# Altium schematic sheet Voltage Controller.SchDoc
size A4
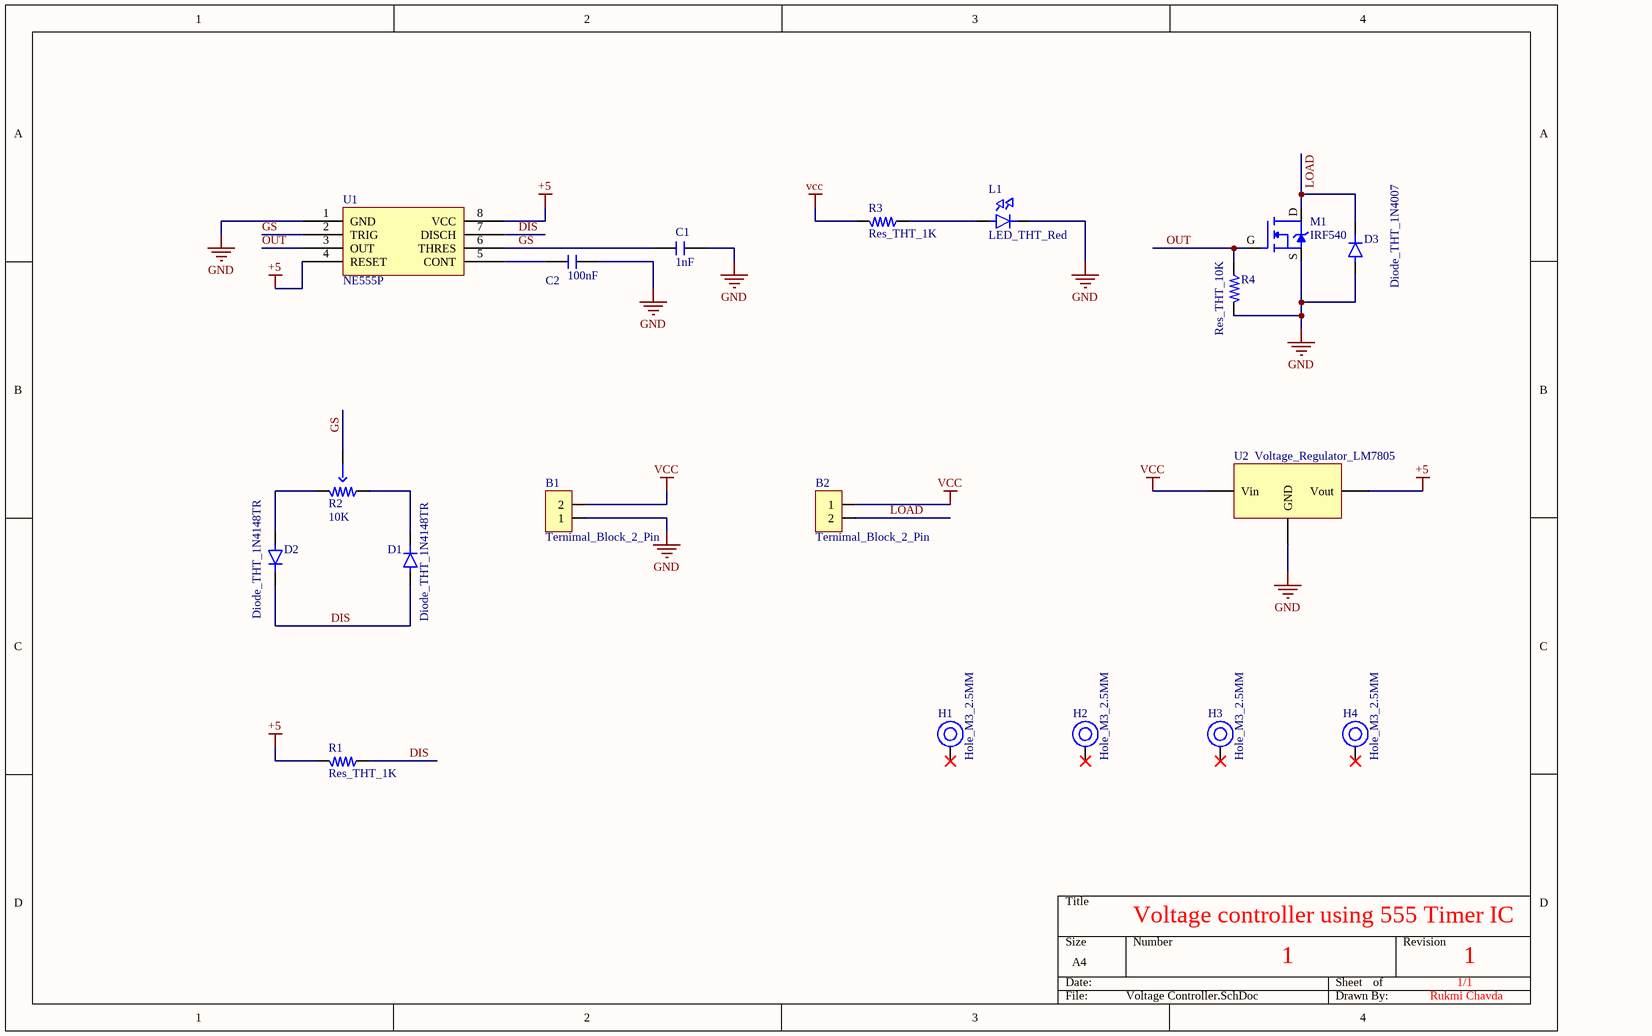
[diagram p0: Voltage Controller.SchDoc]

## Parts
B1  Ternimal_Block_2_Pin  [Ternimal_Block_2_Pin]
B2  Ternimal_Block_2_Pin  [Ternimal_Block_2_Pin]
C1  1nF  [Cap_5.5mm_Cerimic]
C2  100nF  [Cap_5.5mm_Cerimic]
D1  Diode_THT_1N4148TR  [Diode_THT_1N4148TR]
D2  Diode_THT_1N4148TR  [Diode_THT_1N4148TR]
D3  Diode_THT_1N4007  [Diode_1N4007]
H1  Hole_M3_2.5MM  [M3 Hole]  (no BOM)
H2  Hole_M3_2.5MM  [M3 Hole]  (no BOM)
H3  Hole_M3_2.5MM  [M3 Hole]  (no BOM)
H4  Hole_M3_2.5MM  [M3 Hole]  (no BOM)
L1  LED_THT_Red  [LED_THT_Red]
M1  IRF540  [irf540]
R1  Res_THT_1K  [Res_THT_1K]
R2  10K  [Potentiometer_2]
R3  Res_THT_1K  [Res_THT_1K]
R4  Res_THT_10K  [Res_THT_10K]
U1  NE555P  [NE555]
U2  Voltage_Regulator_LM7805  [LM7805_THT]

## Nets
+5: R1.1 U1.4(RESET) U1.8(VCC) U2.3(Vout)
GND: B1.1 C1.2 C2.2 D3.A L1.K M1.S R4.2 U1.1(GND) U2.2(GND)
VCC: B1.2 B2.1 R3.2 U2.1(Vin)
DIS: D1.A D2.K R1.2 U1.7(DISCH)
GS: C1.1 R2.3 U1.2(TRIG) U1.6(THRES)
LOAD: B2.2 D3.K M1.D
OUT: M1.G R4.1 U1.3(OUT)
NetC2_1: C2.1 U1.5(CONT)
NetD1_K: D1.K R2.1
NetD2_A: D2.A R2.2
NetL1_A: L1.A R3.1

Not connected (* = marked no-connect by the designer): H1 1*; H2 1*; H3 1*; H4 1*

## Notes on the sheet
- Voltage controller using 555 Timer IC
- 1
- 1/1
- Rukmi Chavda

## Library data of the parts
B1 B2 = Ternimal_Block_2_Pin: Connector
C1 C2 = Cap_THT_5.5mm_Cerimic: CERAMIC  pich 6mm diameter 5mm
D1 D2 = Diode_THT_1N4148TR: ON SEMICONDUCTOR - 1N4148TR - Small Signal Diode, Single, 100 V, 200 mA, 1 V, 4 ns, 1 A RoHS Compliant: Yes; Max Reverse Voltage (DC): 100V; Average Rectified Current: 200mA; Reverse Recovery Time: 4ns; Supplier 1: Digi-Key; Manufacturer: ON Semiconductor; Manufacturer Part Number: 1N4148TR; RoHS: No; Category: Rectifier Diodes; Stock 1: 174333; Pricing 1: 1=0.10000, 10=0.05400, 100=0.02060, 500=0.01506, 1000=0.01011, 2000=0.01002, 5000=0.00968 (USD); Mount: Through Hole; Packaging: Cut Tape; ComponentLink1URL: http://www.farnell.com/datasheets/1934602.pdf?src-supplier=Farnell; ComponentLink1Description: http://www.farnell.com/datasheets/1934602.pdf?src-supplier=Farnell; ComponentLink2URL: http://www.farnell.com/datasheets/1934602.pdf?src-supplier=Newark; ComponentLink2Description: http://www.farnell.com/datasheets/1934602.pdf?src-supplier=Newark; ComponentLink3URL: http://www.farnell.com/datasheets/1934602.pdf?src-supplier=Element14; ComponentLink3Description: http://www.farnell.com/datasheets/1934602.pdf?src-supplier=Element14; ComponentLink4URL: https://www.fairchildsemi.com/datasheets/1N/1N914.pdf?src-supplier=Digi-Key; ComponentLink4Description: https://www.fairchildsemi.com/datasheets/1N/1N914.pdf?src-supplier=Digi-Key; Supplier Part Number 1: 1N4148FSCT-ND
D3 = Diode_THT_1N4007: Diode 1KV 1A 2-Pin DO-41 T/R; Manufacturer 1: ON Semiconductor / Fairchild; Manufacturer Part Number 1: 1N4007; Forward Voltage: 1.1V; Polarity: Standard; Peak Non-Repetitive Surge Current: 30A; Element Configuration: Single; Capacitance: 15pF; Peak Reverse Current: 5uA; Power Dissipation: 3W; Supplier 1: Digi-Key; RoHS: Yes; Category: Integrated Circuits (ICs); Pricing 1: 1=0.18000, 10=0.16800, 100=0.09120, 500=0.05614, 1000=0.03827 (USD); Mount: Through Hole; Number of Pins: 2; Weight: 0.245g; Contact Plating: Tin,Matte; Min Operating Temperature: -65°C; Max Operating Temperature: 175°C; Packaging: Tape and Reel; Voltage Rating (DC): 1kV; Current Rating: 1A; Output Current: 1A; Max Surge Current: 30A; Forward Current: 1A; Max Repetitive Reverse Voltage (Vrrm): 1kV; Max Forward Surge Current (Ifsm): 30A; Package Quantity: 1000; Reverse Voltage: 1kV; Average Rectified Current: 1A; Max Reverse Voltage (DC): 1kV; Diameter: 2.72mm; Length: 5.2mm; Height: 5.2mm; Width: 2.72mm; Radiation Hardening: No; REACH SVHC: No SVHC; Lead Free: Lead Free; ComponentLink1URL: https://datasheet.ciiva.com/1239/1n4005-1239313.pdf?src-supplier=Newark; ComponentLink1Description: https://datasheet.ciiva.com/1239/1n4005-1239313.pdf?src-supplier=Newark; ComponentLink2URL: https://datasheet.ciiva.com/927/1n4001-d-927427.pdf?src-supplier=Digi-Key; ComponentLink2Description: https://datasheet.ciiva.com/927/1n4001-d-927427.pdf?src-supplier=Digi-Key; ComponentLink3URL: https://datasheet.ciiva.com/910/1n4001-910361.pdf?src-supplier=Digi-Key; ComponentLink3Description: https://datasheet.ciiva.com/910/1n4001-910361.pdf?src-supplier=Digi-Key; ComponentLink4URL: https://datasheet.ciiva.com/910/1n4001-910362.pdf?src-supplier=Digi-Key; ComponentLink4Description: https://datasheet.ciiva.com/910/1n4001-910362.pdf?src-supplier=Digi-Key; Supplier Part Number 1: 1N4007FSCT-ND
H1-H4 = Hole_M3_2.5MM: Mounting hole
L1 = LED_THT_Red: LED RED CLEAR 5MM OVAL T/H; Manufacturer 1: Cree; Manufacturer Part Number 1: C5SMF-RJF-CT0W0BB1; Test Current: 20mA; Dominant Wavelength: 621nm; Forward Voltage: 2.1V; Luminous Intensity: 2640mcd; Lens Style: Elliptical; Viewing Angle: 40°; Supplier 1: Digi-Key; RoHS: Yes; Category: LEDs; Stock 1: 17201; Pricing 1: 1=0.14000, 10=0.13200, 100=0.12160, 1000=0.10877, 50000=0.10100 (USD); Mount: Through Hole; Case/Package: Radial; Color: Red; Lens Color: Red; Min Operating Temperature: -40°C; Max Operating Temperature: 95°C; Illumination Color: Red; Forward Current: 20mA; Package Quantity: 500; Packaging: Bulk; Lens Transparency: Clear; Height: 10.95mm; ComponentLink1URL: https://datasheet.ciiva.com/29562/c5smfrjfrjegjfgjebjfbje1240-29562716.pdf?src-supplier=Digi-Key; ComponentLink1Description: https://datasheet.ciiva.com/29562/c5smfrjfrjegjfgjebjfbje1240-29562716.pdf?src-supplier=Digi-Key; Supplier Part Number 1: C5SMF-RJF-CT0W0BB1-ND
M1 = IRF540: MOSFET N, 100 V 28 A 150 W TO-220, IRF540PBF, Vishay; Voltage Rating (DC): 100V; Current Rating: 28A; Drain to Source Resistance: 77mR; Gate to Source Voltage (Vgs): 20V; Power Dissipation: 150W; Element Configuration: Single; Fall Time: 43ns; Turn-Off Delay Time: 53ns; Threshold Voltage: 4V; Turn-On Delay Time: 11ns; Recovery Time: 360ns; Number of Channels: 1; Rise Time: 44ns; Input Capacitance: 1.7nF; Supplier 1: Digi-Key; Manufacturer 1: Vishay; Manufacturer Part Number 1: IRF540PBF; RoHS: Yes; Category: MOSFETs; Stock 1: 4767; Pricing 1: 1=1.61000, 10=1.44600, 25=1.36400, 100=1.06390, 250=1.03664, 500=0.90024, 1000=0.76384, 2500=0.75293, 5000=0.69837 (USD); Mount: Through Hole; Case/Package: TO-220AB; Number of Pins: 3; Weight: 0.211644oz; Min Operating Temperature: -55°C; Max Operating Temperature: 175°C; Drain to Source Breakdown Voltage: 100V; Continuous Drain Current (ID): 28A; Packaging: Rail/Tube; Current: 28A; Voltage: 100V; Drain to Source Voltage (Vdss): 100V; On-State Resistance: 77mR; Nominal Vgs: 4V; Package Quantity: 1000; Number of Elements: 1; Max Power Dissipation: 150W; Rds On Max: 77mR; Length: 10.51mm; Height: 9.01mm; Width: 4.7mm; Radiation Hardening: No; Lead Free: Lead Free; REACH SVHC: Unknown; ComponentLink1URL: https://datasheet.ciiva.com/6932/91021-6932497.pdf?src-supplier=Newark; ComponentLink1Description: https://datasheet.ciiva.com/6932/91021-6932497.pdf?src-supplier=Newark; ComponentLink2URL: https://datasheet.ciiva.com/13042/91021-106567-13042674.pdf?src-supplier=Mouser; ComponentLink2Description: https://datasheet.ciiva.com/13042/91021-106567-13042674.pdf?src-supplier=Mouser; ComponentLink3URL: https://datasheet.ciiva.com/16978/0900766b80e6df42-16978663.pdf?src-supplier=Allied+Electronics; ComponentLink3Description: https://datasheet.ciiva.com/16978/0900766b80e6df42-16978663.pdf?src-supplier=Allied+Electronics; ComponentLink4URL: https://datasheet.ciiva.com/15137/getdatasheetpartid-93465-15137768.pdf?src-supplier=Verical; ComponentLink4Description: https://datasheet.ciiva.com/15137/getdatasheetpartid-93465-15137768.pdf?src-supplier=Verical; ComponentLink5URL: https://datasheet.ciiva.com/14110/coirf540-data-en-14110684.pdf?src-supplier=Distrelec; ComponentLink5Description: https://datasheet.ciiva.com/14110/coirf540-data-en-14110684.pdf?src-supplier=Distrelec; ComponentLink6URL: https://datasheet.ciiva.com/26791/irf540pbf-26791165.pdf?src-supplier=IIIC; ComponentLink6Description: https://datasheet.ciiva.com/26791/irf540pbf-26791165.pdf?src-supplier=IIIC; ComponentLink7URL: https://datasheet.ciiva.com/18432/70078851-18432471.pdf?src-supplier=Allied+Electronics; ComponentLink7Description: https://datasheet.ciiva.com/18432/70078851-18432471.pdf?src-supplier=Allied+Electronics; ComponentLink8URL: https://datasheet.ciiva.com/16210/91021-16210234.pdf?src-supplier=Future+Electronics; ComponentLink8Description: https://datasheet.ciiva.com/16210/91021-16210234.pdf?src-supplier=Future+Electronics; ComponentLink9URL: https://datasheet.ciiva.com/26146/91021-26146794.pdf?src-supplier=Avnet+Europe; ComponentLink9Description: https://datasheet.ciiva.com/26146/91021-26146794.pdf?src-supplier=Avnet+Europe; Supplier Part Number 1: IRF540PBF-ND
R1 R3 = Res_THT_1K: Res Carbon Film 1K Ohm 5% 0.25W(1/4W) -400ppm/? to 0ppm/? Conformal Coated AXL T/R; Manufacturer 1: Stackpole Electronics; Manufacturer Part Number 1: CF14JT1K00; Max Power Dissipation: 250mW; Temperature Coefficient: -400ppm/°C; Resistance: 1kR; Supplier 1: Digi-Key; RoHS: Yes; Category: Through-Hole Resistors; Stock 1: 806014; Pricing 1: 1=0.10000, 10=0.04000, 25=0.02880, 50=0.02200, 100=0.01620, 250=0.01236, 500=0.00990, 1000=0.00729 (USD); Mount: Through Hole,Axial; Case/Package: Conformal; Contact Plating: Tin,Matte; Min Operating Temperature: -55°C; Max Operating Temperature: 155°C; Features: Flame Retardant Coating; Composition: Carbon Film; Number of Terminations: 2; Termination: Axial; Military Standard: Not; Packaging: Tape and Reel; Package Quantity: 1; Power Rating: 250mW; Diameter: 2.3mm; Length: 6.5mm; Radiation Hardening: No; Lead Free: Lead Free; ComponentLink1URL: http://www.seielect.com/Catalog/SEI-CF_CFM.pdf?src-supplier=Future+Electronics; ComponentLink1Description: http://www.seielect.com/Catalog/SEI-CF_CFM.pdf?src-supplier=Future+Electronics; ComponentLink2URL: https://www.seielect.com/catalog/SEI-CF_CFM.pdf?src-supplier=Avnet; ComponentLink2Description: https://www.seielect.com/catalog/SEI-CF_CFM.pdf?src-supplier=Avnet; ComponentLink3URL: https://www.seielect.com/catalog/SEI-Packaging.pdf?src-supplier=Digi-Key; ComponentLink3Description: https://www.seielect.com/catalog/SEI-Packaging.pdf?src-supplier=Digi-Key; ComponentLink4URL: https://www.seielect.com/Catalog/SEI-CF_CFM.pdf?src-supplier=Digi-Key; ComponentLink4Description: https://www.seielect.com/Catalog/SEI-CF_CFM.pdf?src-supplier=Digi-Key; ComponentLink5URL: http://components.arrow.com/part/dataview/27620077S9848643N1174?src-supplier=Arrow; ComponentLink5Description: http://components.arrow.com/part/dataview/27620077S9848643N1174?src-supplier=Arrow; ComponentLink6URL: https://www.verical.com/server-webapp/html/getDatasheet?partID=360403&src-supplier=Verical; ComponentLink6Description: https://www.verical.com/server-webapp/html/getDatasheet?partID=360403&src-supplier=Verical; Supplier Part Number 1: CF14JT1K00CT-ND; Tolerance: 5%
R2 = Potentiometer_THT_2: Comman for all values
R4 = Res_THT_10K: RES 10K OHM 1/4W 5% AXIAL; Manufacturer 1: Stackpole Electronics; Manufacturer Part Number 1: CF14JT10K0; Temperature Coefficient: -500ppm/°C; Max Power Dissipation: 250mW; Resistance: 10kR; Supplier 1: Digi-Key; RoHS: Yes; Category: Through-Hole Resistors; Stock 1: 746193; Pricing 1: 1=0.10000, 10=0.04000, 25=0.02880, 50=0.02200, 100=0.01620, 250=0.01236, 500=0.00990, 1000=0.00729 (USD); Mount: Through Hole,Axial; Case/Package: Conformal; Contact Plating: Tin,Matte; Min Operating Temperature: -55°C; Max Operating Temperature: 155°C; Number of Terminations: 2; Military Standard: Not; Termination: Axial; Features: Flame Retardant Coating; Packaging: Tape and Reel; Tolerance: 5%; Power Rating: 250mW; Package Quantity: 1; Composition: Carbon Film; Diameter: 2.3mm; Length: 6.5mm; Radiation Hardening: No; Lead Free: Lead Free; ComponentLink1URL: https://www.verical.com/server-webapp/html/getDatasheet?partID=367360&src-supplier=Verical; ComponentLink1Description: https://www.verical.com/server-webapp/html/getDatasheet?partID=367360&src-supplier=Verical; ComponentLink2URL: https://www.seielect.com/catalog/SEI-CF_CFM.pdf?src-supplier=Avnet; ComponentLink2Description: https://www.seielect.com/catalog/SEI-CF_CFM.pdf?src-supplier=Avnet; ComponentLink3URL: http://www.seielect.com/Catalog/SEI-CF_CFM.pdf?src-supplier=Future+Electronics; ComponentLink3Description: http://www.seielect.com/Catalog/SEI-CF_CFM.pdf?src-supplier=Future+Electronics; ComponentLink4URL: https://www.seielect.com/catalog/SEI-Packaging.pdf?src-supplier=Digi-Key; ComponentLink4Description: https://www.seielect.com/catalog/SEI-Packaging.pdf?src-supplier=Digi-Key; ComponentLink5URL: http://components.arrow.com/part/dataview/27619991S9848636N1174?src-supplier=Arrow; ComponentLink5Description: http://components.arrow.com/part/dataview/27619991S9848636N1174?src-supplier=Arrow; Supplier Part Number 1: CF14JT10K0CT-ND
U1 = NE555P: Standard Timer Single 8-Pin PDIP Tube; Manufacturer: Texas Instruments; Frequency: 500kHz; Min Supply Voltage: 4.5V; Max Supply Voltage: 16V; Operating Supply Voltage: 5V; Current Rating: 10mA; Nominal Supply Current: 2mA; Number of Timers/Counters: 1; Quiescent Current: 15mA; High Level Output Current: -200mA; Low Level Output Current: 200mA; Supplier 1: Digi-Key; Manufacturer Part Number: NE555P; RoHS: Yes; Category: Clock and Timing; Stock 1: 20689; Pricing 1: 1=0.45000, 10=0.34200, 25=0.30800, 100=0.21280, 250=0.17920, 500=0.14560, 1000=0.11200, 2500=0.10080, 5000=0.09520 (USD); Mount: Through Hole; Case/Package: PDIP; Number of Pins: 8; Weight: 0.015535oz; Contact Plating: Gold; Min Operating Temperature: 0°C; Max Operating Temperature: 70°C; Packaging: Rail/Tube; Package Quantity: 50; Operating Supply Current: 10mA; Length: 9.81mm; Height: 4.57mm; Width: 6.35mm; Radiation Hardening: No; REACH SVHC: No SVHC; Lead Free: Lead Free; ComponentLink1URL: https://datasheet.ciiva.com/1139/sa555-1139904.pdf?src-supplier=Element14; ComponentLink1Description: https://datasheet.ciiva.com/1139/sa555-1139904.pdf?src-supplier=Element14; ComponentLink2URL: https://datasheet.ciiva.com/19457/904085-19457361.pdf?src-supplier=Jameco; ComponentLink2Description: https://datasheet.ciiva.com/19457/904085-19457361.pdf?src-supplier=Jameco; ComponentLink3URL: https://datasheet.ciiva.com/26325/152184-da-01-en-ne555p-timer-tid-26325915.pdf?src-supplier=Conrad; ComponentLink3Description: https://datasheet.ciiva.com/26325/152184-da-01-en-ne555p-timer-tid-26325915.pdf?src-supplier=Conrad; ComponentLink4URL: https://datasheet.ciiva.com/1147/1764032-1147750.pdf?src-supplier=Newark; ComponentLink4Description: https://datasheet.ciiva.com/1147/1764032-1147750.pdf?src-supplier=Newark; ComponentLink5URL: https://datasheet.ciiva.com/14094/ne555-series-eng-tds-14094950.pdf?src-supplier=Distrelec; ComponentLink5Description: https://datasheet.ciiva.com/14094/ne555-series-eng-tds-14094950.pdf?src-supplier=Distrelec; ComponentLink6URL: https://datasheet.ciiva.com/14274/ne555-14274456.pdf?src-supplier=Avnet; ComponentLink6Description: https://datasheet.ciiva.com/14274/ne555-14274456.pdf?src-supplier=Avnet; ComponentLink7URL: https://datasheet.ciiva.com/15152/getdatasheetpartid-248510-15152620.pdf?src-supplier=Verical; ComponentLink7Description: https://datasheet.ciiva.com/15152/getdatasheetpartid-248510-15152620.pdf?src-supplier=Verical; ComponentLink8URL: https://datasheet.ciiva.com/26228/ne555-26228892.pdf?src-supplier=Avnet+Europe; ComponentLink8Description: https://datasheet.ciiva.com/26228/ne555-26228892.pdf?src-supplier=Avnet+Europe; Supplier Part Number 1: 296-NE555P-ND
U2 = Voltage_Regulator_LM7805: STMICROELECTRONICS 	   	L7805CV 	   	Linear Voltage Regulators & Vref; Manufacturer Part Number 1: L7805C-V; Dropout Voltage: 2V; Max Input Voltage: 35V; Output Current: 1.5A; Output Voltage: 5V; Number of Outputs: 1; Min Input Voltage: 7V; Polarity: Positive; Quiescent Current: 8mA; Tolerance: 5%; Power Supply Rejection Ratio (PSRR): 62dB; Output Type: Fixed; Supplier 1: Digi-Key; Manufacturer 1: STMicroelectronics; RoHS: Yes; Category: Voltage Regulators - Linear; Stock 1: 28903; Pricing 1: 1=0.50000, 10=0.42600, 25=0.39800, 100=0.29560, 250=0.25016, 500=0.23878, 1000=0.17624, 2500=0.16486, 5000=0.15350 (USD); Mount: Through Hole; Case/Package: TO; Number of Pins: 3; Weight: 0.08113oz; Contact Plating: Gold; Min Operating Temperature: 0°C; Max Operating Temperature: 125°C; Package Quantity: 1000; Packaging: Rail/Tube; Max Output Current: 1.5A; Nominal Output Voltage: 5V; Number of Regulators: 1; Min Output Voltage: 5V; Output Configuration: Positive; Length: 10.4mm; Height: 9.15mm; Width: 4.6mm; Radiation Hardening: No; REACH SVHC: No SVHC; Lead Free: Lead Free; ComponentLink1URL: https://datasheet.ciiva.com/15111/getdatasheetpartid-44136-15111027.pdf?src-supplier=Verical; ComponentLink1Description: https://datasheet.ciiva.com/15111/getdatasheetpartid-44136-15111027.pdf?src-supplier=Verical; ComponentLink2URL: https://datasheet.ciiva.com/19480/924633-19480531.pdf?src-supplier=Jameco; ComponentLink2Description: https://datasheet.ciiva.com/19480/924633-19480531.pdf?src-supplier=Jameco; ComponentLink3URL: https://datasheet.ciiva.com/26347/47-3290e-26347739.pdf?src-supplier=Rapid+Electronics; ComponentLink3Description: https://datasheet.ciiva.com/26347/47-3290e-26347739.pdf?src-supplier=Rapid+Electronics; ComponentLink4URL: https://datasheet.ciiva.com/29156/156048-da-01-en-spannungsregler-l-7805-cv-to220-stm-29156924.pdf?src-supplier=Conrad; ComponentLink4Description: https://datasheet.ciiva.com/29156/156048-da-01-en-spannungsregler-l-7805-cv-to220-stm-29156924.pdf?src-supplier=Conrad; ComponentLink5URL: https://datasheet.ciiva.com/2043/cd00000444-2043986.pdf?src-supplier=Digi-Key; ComponentLink5Description: https://datasheet.ciiva.com/2043/cd00000444-2043986.pdf?src-supplier=Digi-Key; ComponentLink6URL: https://datasheet.ciiva.com/1511/1805459-1511914.pdf?src-supplier=Element14; ComponentLink6Description: https://datasheet.ciiva.com/1511/1805459-1511914.pdf?src-supplier=Element14; ComponentLink7URL: https://datasheet.ciiva.com/14149/tel78xx-l78xxc-e-14149770.pdf?src-supplier=Distrelec; ComponentLink7Description: https://datasheet.ciiva.com/14149/tel78xx-l78xxc-e-14149770.pdf?src-supplier=Distrelec; ComponentLink8URL: https://datasheet.ciiva.com/1511/1805459-1511915.pdf?src-supplier=Element14; ComponentLink8Description: https://datasheet.ciiva.com/1511/1805459-1511915.pdf?src-supplier=Element14; ComponentLink9URL: https://datasheet.ciiva.com/1512/1805459-1512333.pdf?src-supplier=Element14; ComponentLink9Description: https://datasheet.ciiva.com/1512/1805459-1512333.pdf?src-supplier=Element14; Supplier Part Number 1: 497-1443-5-ND